# EAGLE schematic control_rev_2 (EAGLE 6.3)
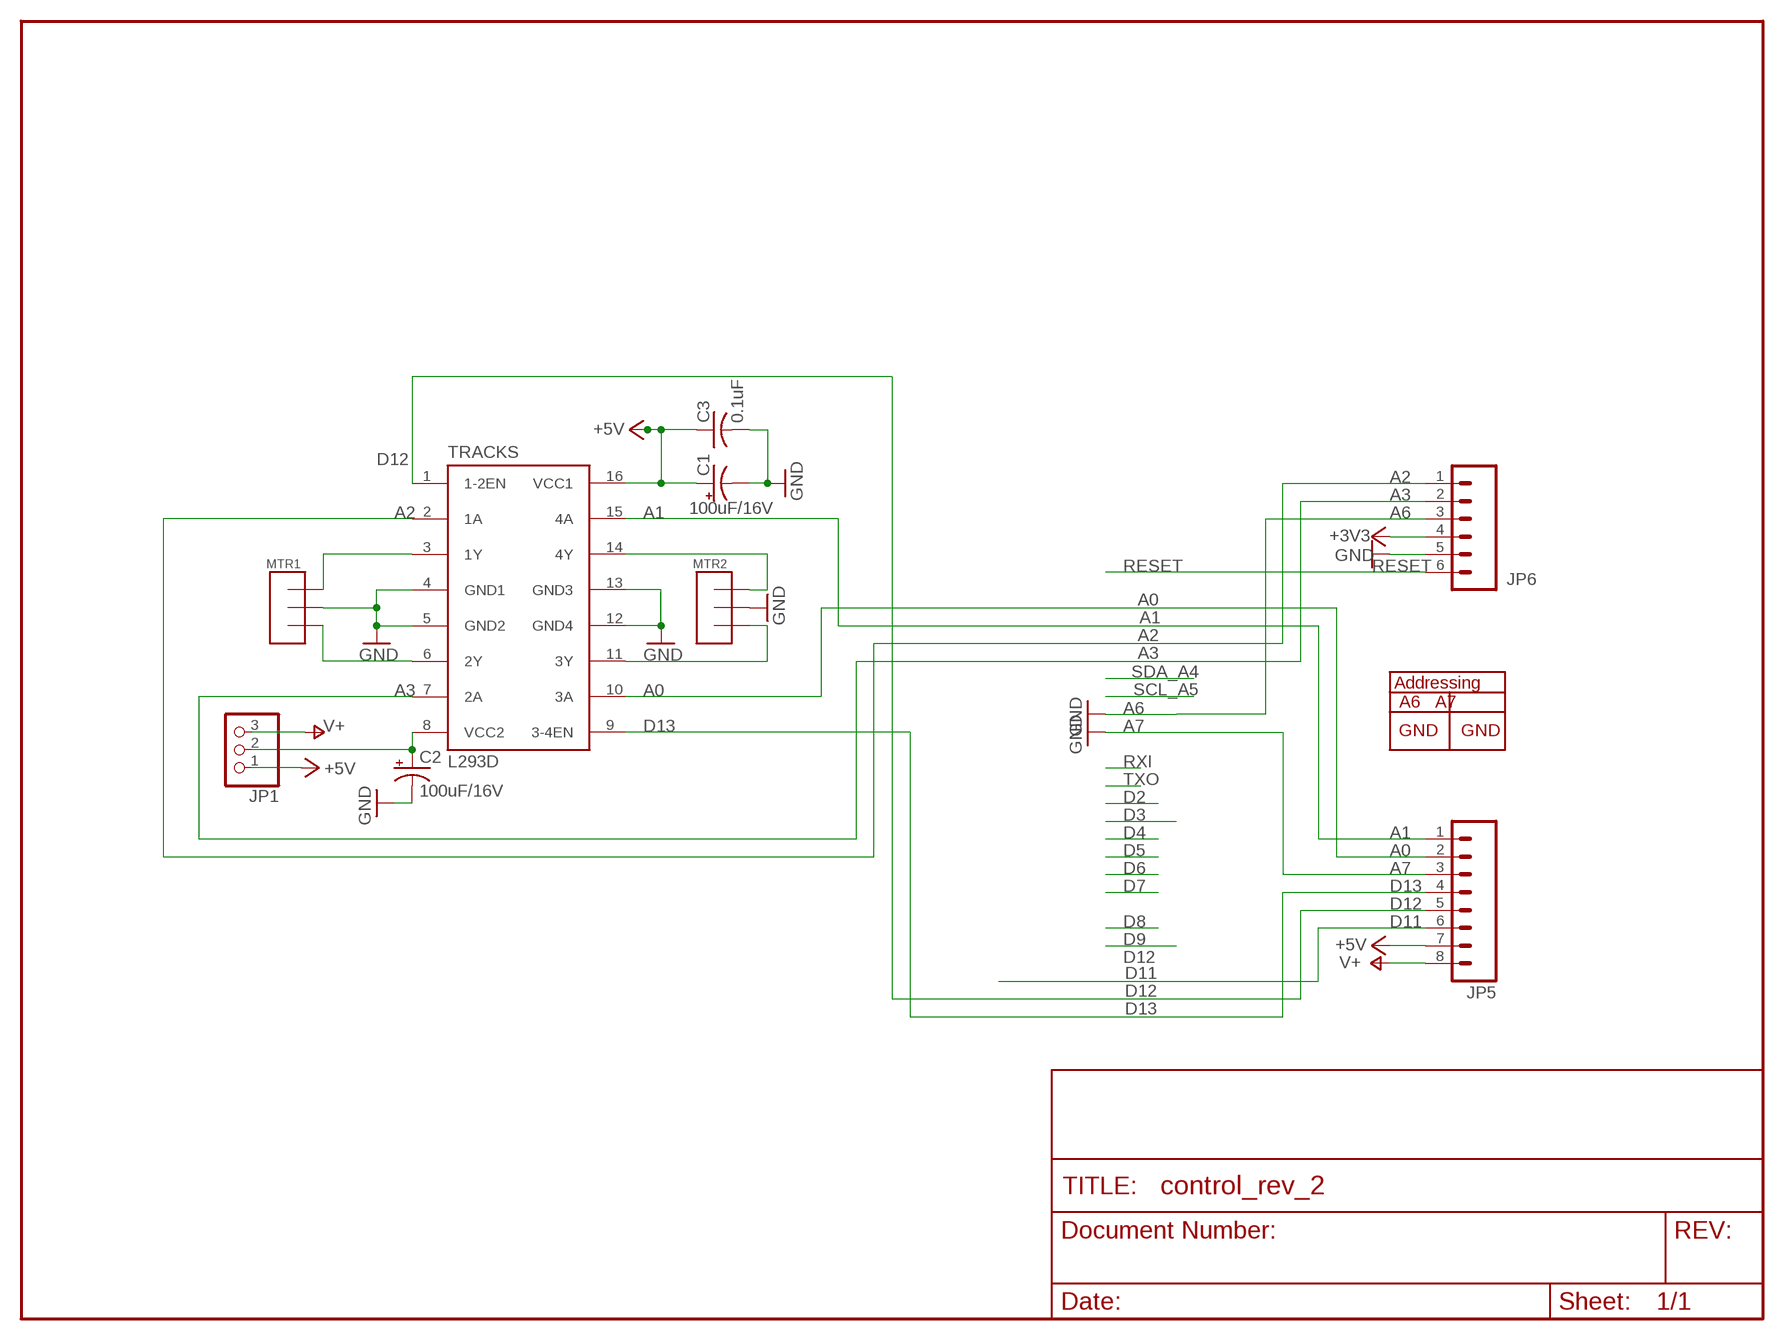
[diagram p0: schematic, sheet 1]

## Parts
C1  100uF/16V  CPOL-USE2.5-6  [E2,5-6]
C2  100uF/16V  CPOL-USE2.5-6  [E2,5-6]
C3  0.1uF  C-US025-025X050  [C025-025X050]
JP1  PINHD-1X3  [1X03]
JP5  M081X08  [1X08]
JP6  M06SIP  [1X06]
MTR1  TERMINAL  [TERMINAL_3]
MTR2  TERMINAL  [TERMINAL_3]
TRACKS  L293D  L293E  [DIL16]

## Nets
+3V3: JP6.4
+5V: C1.+ C3.1 JP1.1 JP5.7 TRACKS.16(VCC1)
A0: JP5.2 TRACKS.10(3A)
A1: JP5.1 TRACKS.15(4A)
A2: JP6.1 TRACKS.2(1A)
A3: JP6.2 TRACKS.7(2A)
A6: JP6.3 ; supply symbol labelled GND
A7: JP5.3 ; supply symbol labelled GND
D11: JP5.6
D12: JP5.5 TRACKS.1(1-2EN)
D13: JP5.4 TRACKS.9(3-4EN)
GND: C1.- C2.- C3.2 JP6.5 MTR1.P$2 MTR2.P$2 TRACKS.4(GND1) TRACKS.5(GND2) TRACKS.12(GND4) TRACKS.13(GND3)
N$1: MTR1.P$1 TRACKS.3(1Y)
N$2: MTR2.P$1 TRACKS.14(4Y)
N$3: MTR1.P$3 TRACKS.6(2Y)
N$4: MTR2.P$3 TRACKS.11(3Y)
N$8: C2.+ JP1.2 TRACKS.8(VCC2)
RESET: JP6.6
V+: JP1.3 JP5.8

## Library data of the parts
C1 C2 = rcl-ez:CPOL-US: POLARIZED CAPACITOR, American symbol
C3 = rcl-ez:C-US: CAPACITOR, American symbol
JP1 = adafruit_mod:PINHD-1X3: PIN HEADER
JP5 = SparkFun_mod:M08: Header 8 Standard 8-pin 0.1" header. Use with straight break away headers (SKU : PRT-00116), right angle break away headers (PRT-00553), swiss pins (PRT-00743), machine pins (PRT-00117), and female headers (PRT-00115).
JP6 = SparkFun:M06: Header 6 Standard 6-pin 0.1" header. Use with straight break away headers (SKU : PRT-00116), right angle break away headers (PRT-00553), swiss pins (PRT-00743), machine pins (PRT-00117), and female headers (PRT-00115). Molex polarized connector foot print use with SKU : PRT-08094 with associated crimp pins and housings. NOTES ON THE VARIANTS LOCK and LOCK_LONGPADS... This footprint was designed to help hold the alignment of a through-hole component (i.e. 6-pin header) while soldering it into place. You may notice that each hole has been shifted either up or down by 0.005 of an inch from it's more standard position (which is a perfectly straight line). This slight alteration caused the pins (the squares in the middle) to touch the edges of the holes. Because they are alternating, it causes a "brace" to hold the component in place. 0.005 has proven to be the perfect amount of "off-center" position when using our standard breakaway headers. Although looks a little odd when you look at the bare footprint, once you have a header in there, the alteration is very hard to notice. Also, if you push a header all the way into place, it is covered up entirely on the bottom side. This idea of altering the position of holes to aid alignment will be further integrated into the Sparkfun Library for other footprints. It can help hold any component with 3 or more connection pins.
MTR1 MTR2 = _my-parts:TERMINAL
TRACKS = texas:L293E: TI DEVICE

## Net classes
0 default: width 0.203 mm
1 vcc: width 0.254 mm